# EAGLE schematic USB Junctions (EAGLE 7.5.0)
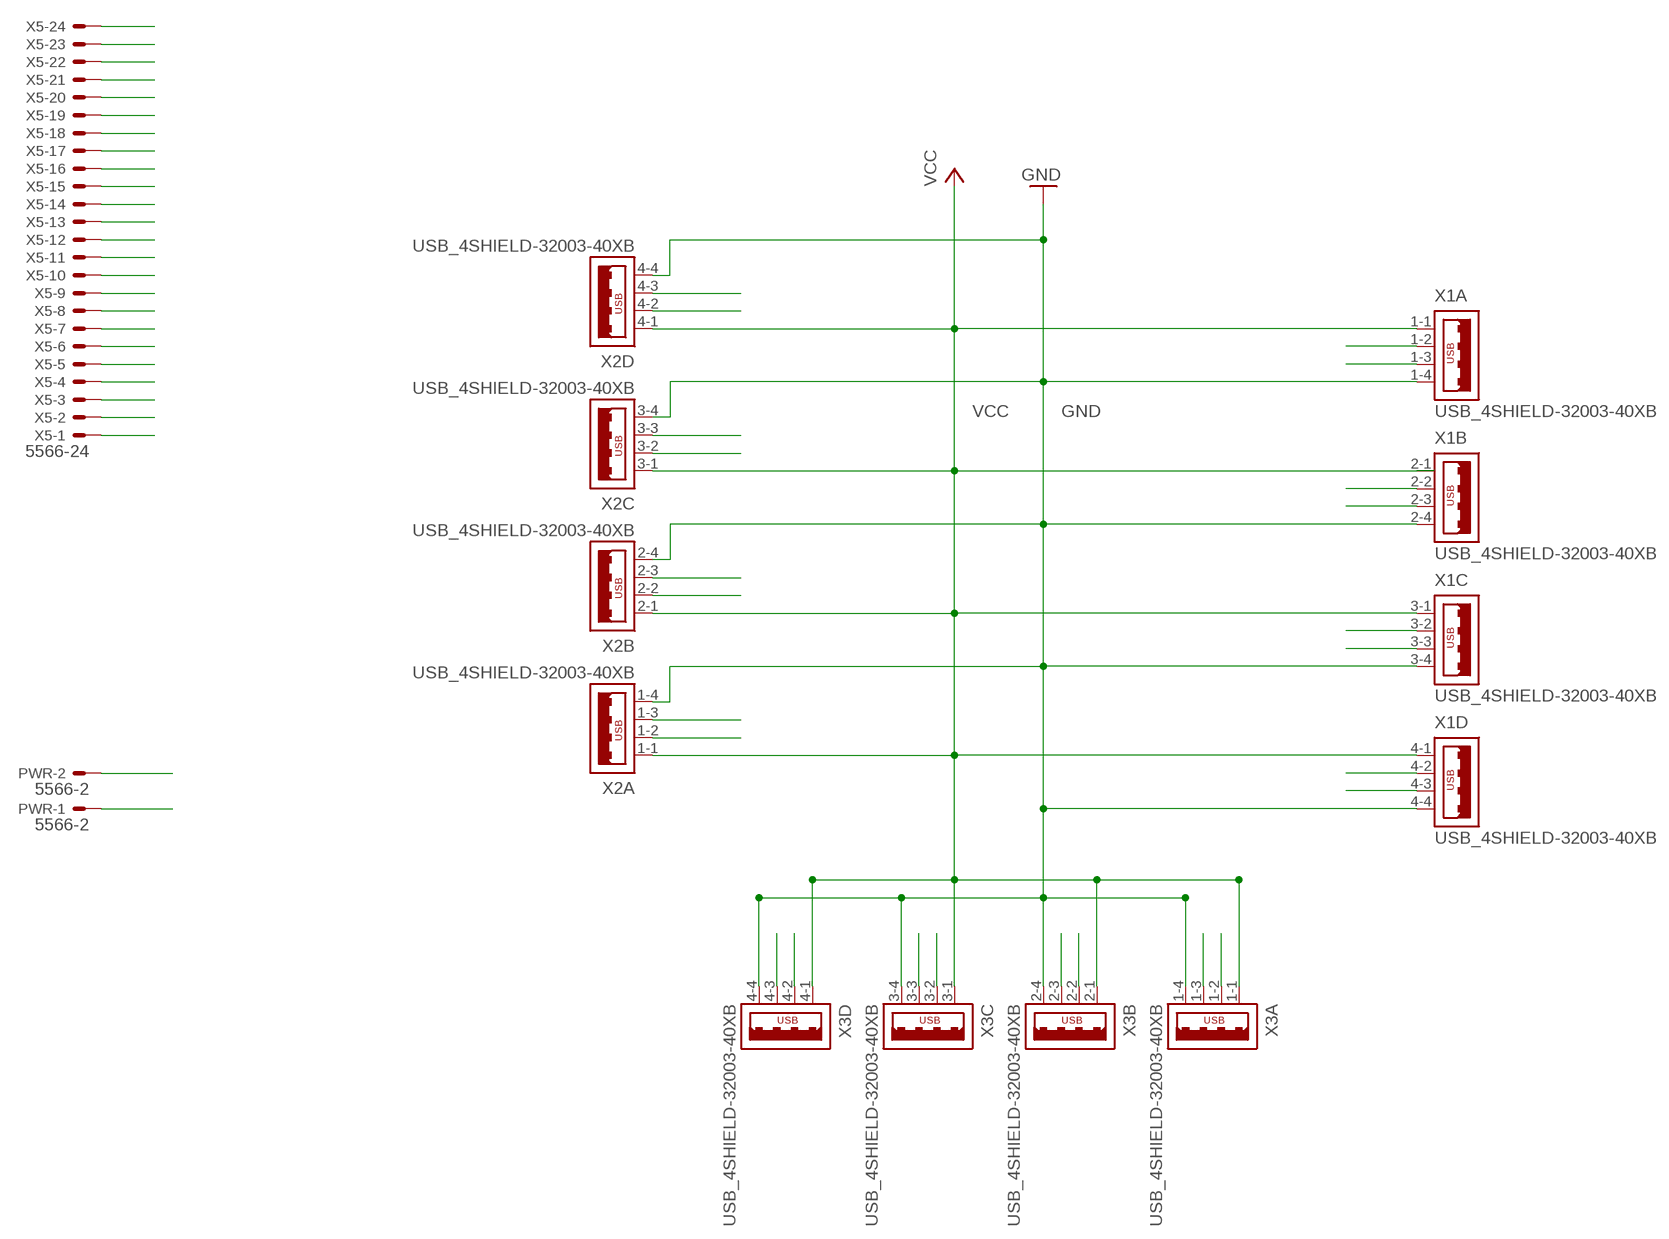
[diagram p0: schematic, sheet 1]

## Parts
PWR  5566-2  [5566-2]
X1  USB_4SHIELD-32003-40XB  [32003-40XB]
X2  USB_4SHIELD-32003-40XB  [32003-40XB]
X3  USB_4SHIELD-32003-40XB  [32003-40XB]
X5  5566-24  [5566-24]

## Nets
D1: X2.1-3 X5.1
D1-: X2.1-2 X5.2
D2: X2.2-3 X5.3
D2-: X2.2-2 X5.4
D3: X2.3-3 X5.5
D3-: X2.3-2 X5.6
D4: X2.4-3 X5.7
D4-: X2.4-2 X5.8
D5: X1.1-3 X5.9
D5-: X1.1-2 X5.10
D6: X1.2-3 X5.11
D6-: X1.2-2 X5.12
D7: X1.3-3 X5.13
D7-: X1.3-2 X5.14
D8: X1.4-3 X5.15
D8-: X1.4-2 X5.16
D9: X3.1-3 X5.17
D9-: X3.1-2 X5.18
D10: X3.2-3 X5.19
D10-: X3.2-2 X5.20
D11: X3.3-3 X5.21
D11-: X3.3-2 X5.22
D12: X3.4-3 X5.23
D12-: X3.4-2 X5.24
GND: PWR.1 X1.1-4 X1.2-4 X1.3-4 X1.4-4 X2.1-4 X2.2-4 X2.3-4 X2.4-4 X3.1-4 X3.2-4 X3.3-4 X3.4-4
VCC: PWR.2 X1.1-1 X1.2-1 X1.3-1 X1.4-1 X2.1-1 X2.2-1 X2.3-1 X2.4-1 X3.1-1 X3.2-1 X3.3-1 X3.4-1

## Library data of the parts
PWR = con-molex:5566-2: Mini FIT connector 2 pol Source: http://www.molex.com; OC_FARNELL: 1822072; OC_NEWARK: unknown
X1-X3 = con-cypressindustries:USB_4SHIELD-: Quad USB Connector Source: www.cypressindustries.com; OC_FARNELL: unknown; OC_NEWARK: unknown
X5 = con-molex:5566-24: Mini FIT connector 24 pol Source: http://www.molex.com; OC_FARNELL: unknown; OC_NEWARK: unknown